# EAGLE schematic LIS331DLH (EAGLE 7.1.0)
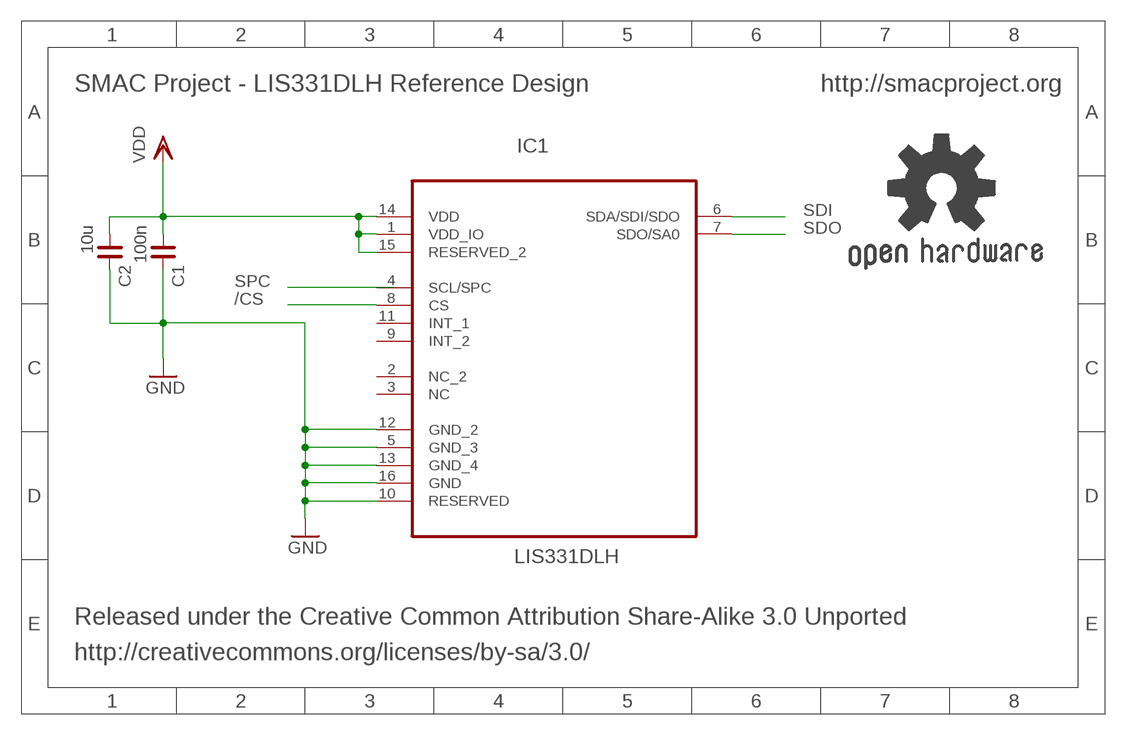
[diagram p0: schematic, sheet 1]

## Parts
C1  100n  C_0402  [C0402]
C2  10u  C_0402  [C0402]
GOLD_ORB_SM2  OSHWLOGO_REF_SM  [OSHW2REF]
IC1  LIS331DLH  [LGA16R50P3X5_300X300X100]

## Nets
/CS: IC1.8(CS)
GND: C1.2 C2.2 IC1.5(GND_3) IC1.10(RESERVED) IC1.12(GND_2) IC1.13(GND_4) IC1.16(GND)
SDI: IC1.6(SDA/SDI/SDO)
SDO: IC1.7(SDO/SA0)
SPC: IC1.4(SCL/SPC)
VDD: C1.1 C2.1 IC1.1(VDD_IO) IC1.14(VDD) IC1.15(RESERVED_2)
Unconnected: IC1.2(NC_2) IC1.3(NC) IC1.9(INT_2) IC1.11(INT_1)

## Notes on the sheet
- SMAC Project - LIS331DLH Reference Design | http://smacproject.org
- Released under the Creative Common Attribution Share-Alike 3.0 Unported
- http://creativecommons.org/licenses/by-sa/3.0/

## Library data of the parts
C1 C2 = rc-master-smd:C_: NON-POLARIZED CAP
GOLD_ORB_SM2 = bfl:OSHWLOGO: These are Open-Source Hardware logos.
IC1 = lis331dlh:LIS331DLH: MEMS motion sensor; MPN: LIS331DLH; OC_FARNELL: 1838523; OC_NEWARK: 09R4846; PACKAGE: LGA-16; SUPPLIER: STMicroelectronics